# Altium schematic sheet seven_segment.SchDoc
size A4; Engineer: Amir Hossein Jobeiri; Organization: Simaran; SheetNumber: 8; SheetTotal: 24
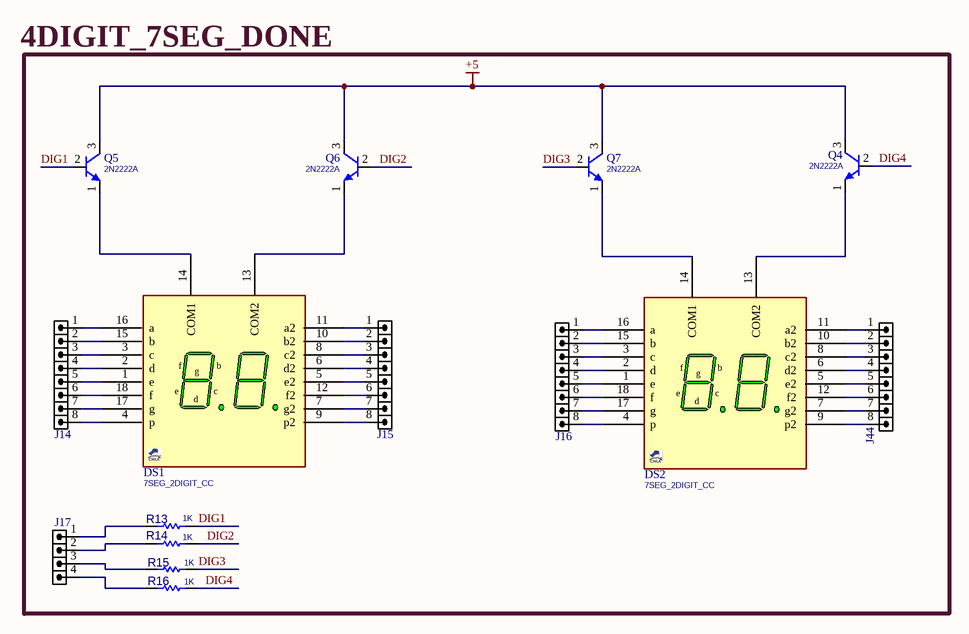
[diagram p0: seven_segment.SchDoc]

## Parts
DS1  7SEG_2DIGIT_CC  [7SEGX2_16]
DS2  7SEG_2DIGIT_CC  [7SEGX2_16]
J14  HDR1X8  [HDR_M_1X8]  (value not drawn)
J15  HDR1X8  [HDR_M_1X8]  (value not drawn)
J16  HDR1X8  [HDR_M_1X8]  (value not drawn)
J17  HDR1X4  [HDR_M_1X4]  (value not drawn)
J44  HDR1X8  [HDR_M_1X8]  (value not drawn)
Q4  2N2222A  [TO92_3]
Q5  2N2222A  [TO92_3]
Q6  2N2222A  [TO92_3]
Q7  2N2222A  [TO92_3]
R13  1K  [R025W_AX04]
R14  1K  [R025W_AX04]
R15  1K  [R025W_AX04]
R16  1K  [R025W_AX04]

## Nets
+5: Q4.3(C) Q5.3(C) Q6.3(C) Q7.3(C)
DIG1: Q5.2(B) R13.1
DIG2: Q6.2(B) R14.1
DIG3: Q7.2(B) R15.1
DIG4: Q4.2(B) R16.1
NetDS1_1: DS1.1(e) J14.5
NetDS1_2: DS1.2(d) J14.4
NetDS1_3: DS1.3(c) J14.3
NetDS1_4: DS1.4(p) J14.8
NetDS1_5: DS1.5(e2) J15.5
NetDS1_6: DS1.6(d2) J15.4
NetDS1_7: DS1.7(g2) J15.7
NetDS1_8: DS1.8(c2) J15.3
NetDS1_9: DS1.9(p2) J15.8
NetDS1_10: DS1.10(b2) J15.2
NetDS1_11: DS1.11(a2) J15.1
NetDS1_12: DS1.12(f2) J15.6
NetDS1_13: DS1.13(COM2) Q6.1(E)
NetDS1_14: DS1.14(COM1) Q5.1(E)
NetDS1_15: DS1.15(b) J14.2
NetDS1_16: DS1.16(a) J14.1
NetDS1_17: DS1.17(g) J14.7
NetDS1_18: DS1.18(f) J14.6
NetDS2_1: DS2.1(e) J16.5
NetDS2_2: DS2.2(d) J16.4
NetDS2_3: DS2.3(c) J16.3
NetDS2_4: DS2.4(p) J16.8
NetDS2_5: DS2.5(e2) J44.5
NetDS2_6: DS2.6(d2) J44.4
NetDS2_7: DS2.7(g2) J44.7
NetDS2_8: DS2.8(c2) J44.3
NetDS2_9: DS2.9(p2) J44.8
NetDS2_10: DS2.10(b2) J44.2
NetDS2_11: DS2.11(a2) J44.1
NetDS2_12: DS2.12(f2) J44.6
NetDS2_13: DS2.13(COM2) Q4.1(E)
NetDS2_14: DS2.14(COM1) Q7.1(E)
NetDS2_15: DS2.15(b) J16.2
NetDS2_16: DS2.16(a) J16.1
NetDS2_17: DS2.17(g) J16.7
NetDS2_18: DS2.18(f) J16.6
NetJ17_1: J17.1 R13.2
NetJ17_2: J17.2 R14.2
NetJ17_3: J17.3 R15.2
NetJ17_4: J17.4 R16.2

## Notes on the sheet
- 4DIGIT_7SEG_DONE

## Library data of the parts
DS1 DS2 = 7SEG_2DIGIT_CC: 7SEGMENT, 2DIGIT, common cathode; VALUE: 7SEG_2DIGIT_CC
J14-J16 J44 = HDR_M_1X8: CONN, HEADER, Male, pitch: 2.54mm, 8POS; VALUE: HDRM8
J17 = HDR_M_1X4: CONN, HEADER, Male, pitch: 2.54mm, 4POS; VALUE: HDRM4
Q4-Q7 = NPN_2N2222A_TO92: BJT, NPN, 40v, 0.6A, THD, TO92; PARAM: 0.6A, hFE100~300; PARAM2: 40v, 625mW; MANF: DIOTEC; MANF_P#: 2N2222A; VALUE: 2N2222A
R13-R16 = RES_THD: RESISTOR, THD; MANF_P#: RK73H1ETTP4701F; MANF: KOA SPEER; PARAM: 0.063W; DESC: DESCRIPTION; DIST#: MOUSER; PARAM2: 1%; ASSEMBLY: ASSEMBLY; PRICE: 100= 0.5$; VALUE: 1K